# Altium schematic sheet LoRa_TX.SchDoc
size A
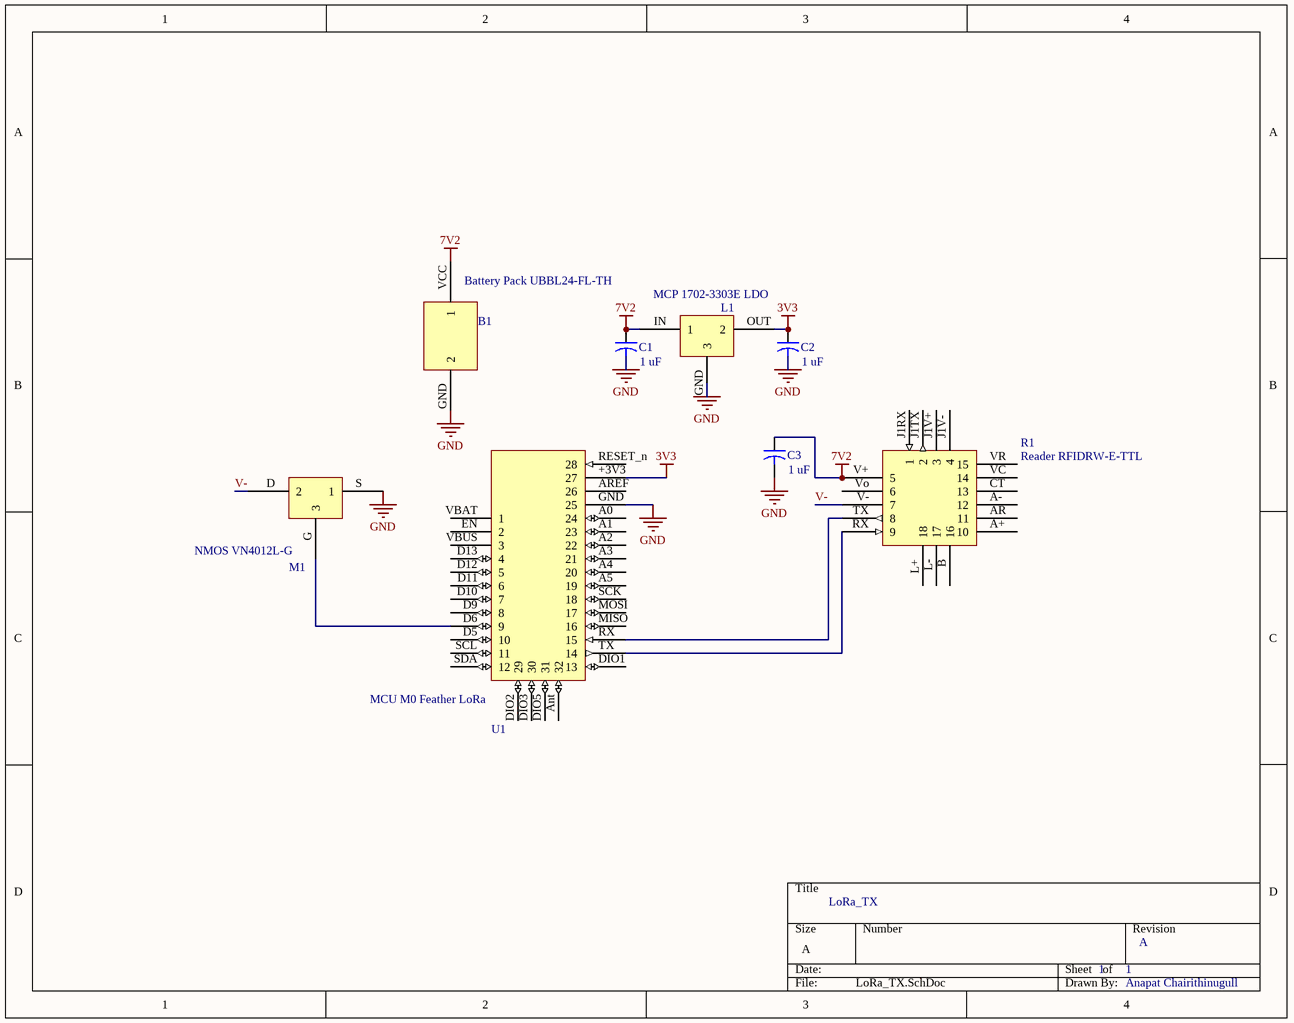
[diagram p0: LoRa_TX.SchDoc]

## Parts
B1  Battery Pack UBBL24-FL-TH
C1  value 1 uF  [CAPR5-4X5]  (hidden comment: Cap2)
C2  value 1 uF  [CAPR5-4X5]  (hidden comment: Cap2)
C3  value 1 uF  [CAPR5-4X5]  (hidden comment: Cap2)
L1  MCP 1702-3303E LDO
M1  NMOS VN4012L-G
R1  Reader RFIDRW-E-TTL
U1  MCU M0 Feather LoRa

## Nets
3V3: C2.1 L1.OUT(2) U1.+3V3(27)
7V2: B1.VCC(1) C1.1 C3.1 L1.IN(1) R1.V+(5)
GND: B1.GND(2) C1.2 C2.2 C3.2 L1.GND(3) M1.S(1) U1.GND(25)
V-: M1.D(2) R1.V-(7)
NetM1_G: M1.G(3) U1.D6(9)
NetR1_RX: R1.RX(9) U1.TX(14)
NetR1_TX: R1.TX(8) U1.RX(15)

Not connected (* = marked no-connect by the designer): R1 A+(10) A-(12) AR(11) B(16) CT(13) J1RX(1) J1TX(2) J1V+(3) J1V-(4) L+(18) L-(17) VC(14) Vo(6) VR(15); U1 A0(24) A1(23) A2(22) A3(21) A4(20) A5(19) Ant(32) AREF(26) D5(10) D9(8) D10(7) D11(6) D12(5) D13(4) DIO1(13) DIO2(29) DIO3(30) DIO5(31) EN(2) MISO(16) MOSI(17) RESET_n(28) SCK(18) SCL(11) SDA(12) VBAT(1) VBUS(3)

## Notes on the sheet
- LoRa_TX
- 1
- A
- Anapat Chairithinugull

## Library data of the parts
C1-C3 = Cap2: Capacitor; Published: 23-Sep-2002; PackageReference: CAPR5-4X5; Publisher: Altium Limited; PackageDescription: Capacitor; 2 Leads
L1 = LDO